# Altium schematic sheet LeaversDinner_invite_Sch.SchDoc
size A3; Author: Duleepa J Thrimawithana; Organization: Power Electronics Group; Address1: The University of Auckland; Address2: 20 Symonds Street; Address3: Auckland 1010; Address4: New Zealand; Revision: 1R0; SheetNumber: 1; SheetTotal: 1
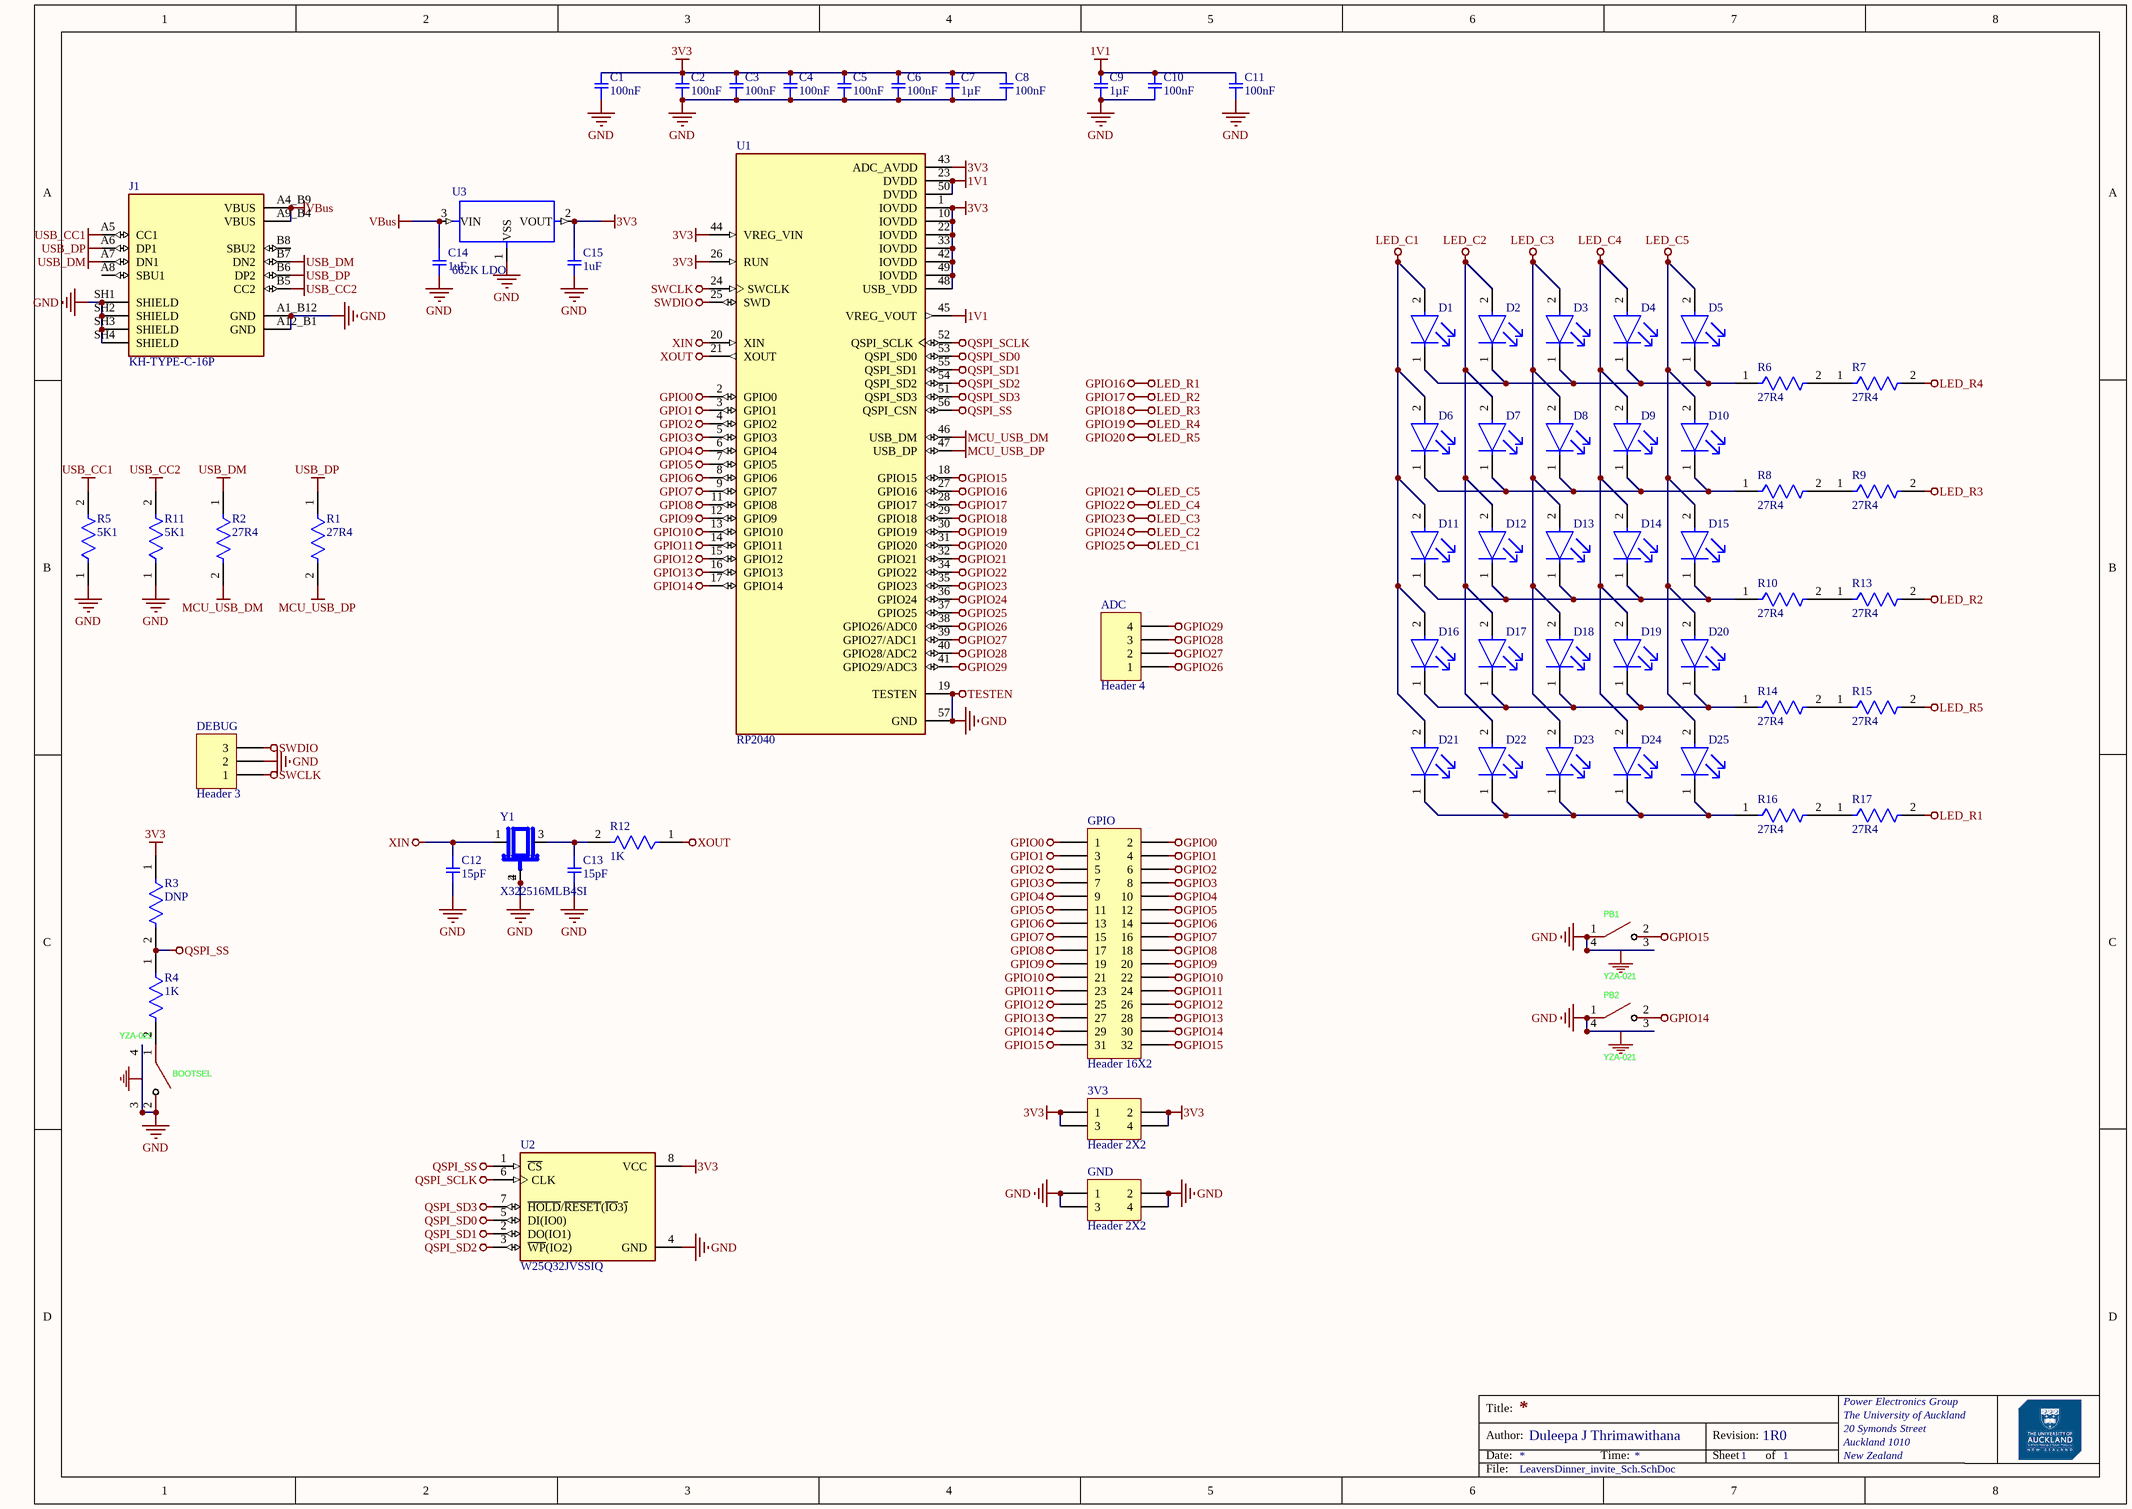
[diagram p0: LeaversDinner_invite_Sch.SchDoc]

## Parts
3V3  Header 2X2  [HDR2X2]
ADC  Header 4  [HDR1X4]
BOOTSEL  YZA-021  [SW-SMD_YZA-021]
C1  100nF  [SMD-0402C]
C2  100nF  [SMD-0402C]
C3  100nF  [SMD-0402C]
C4  100nF  [SMD-0402C]
C5  100nF  [SMD-0402C]
C6  100nF  [SMD-0402C]
C7  1µF  [SMD-0402C]
C8  100nF  [SMD-0402C]
C9  1µF  [SMD-0402C]
C10  100nF  [SMD-0402C]
C11  100nF  [SMD-0402C]
C12  15pF  [SMD-0402C]
C13  15pF  [SMD-0402C]
C14  1uF  [SMD-0402C]
C15  1uF  [SMD-0402C]
D1  VLMW1300-GS08  [FP-6_541-5091_01-4-MFG]  (value not drawn)
D2  VLMW1300-GS08  [FP-6_541-5091_01-4-MFG]  (value not drawn)
D3  VLMW1300-GS08  [FP-6_541-5091_01-4-MFG]  (value not drawn)
D4  VLMW1300-GS08  [FP-6_541-5091_01-4-MFG]  (value not drawn)
D5  VLMW1300-GS08  [FP-6_541-5091_01-4-MFG]  (value not drawn)
D6  VLMW1300-GS08  [FP-6_541-5091_01-4-MFG]  (value not drawn)
D7  VLMW1300-GS08  [FP-6_541-5091_01-4-MFG]  (value not drawn)
D8  VLMW1300-GS08  [FP-6_541-5091_01-4-MFG]  (value not drawn)
D9  VLMW1300-GS08  [FP-6_541-5091_01-4-MFG]  (value not drawn)
D10  VLMW1300-GS08  [FP-6_541-5091_01-4-MFG]  (value not drawn)
D11  VLMW1300-GS08  [FP-6_541-5091_01-4-MFG]  (value not drawn)
D12  VLMW1300-GS08  [FP-6_541-5091_01-4-MFG]  (value not drawn)
D13  VLMW1300-GS08  [FP-6_541-5091_01-4-MFG]  (value not drawn)
D14  VLMW1300-GS08  [FP-6_541-5091_01-4-MFG]  (value not drawn)
D15  VLMW1300-GS08  [FP-6_541-5091_01-4-MFG]  (value not drawn)
D16  VLMW1300-GS08  [FP-6_541-5091_01-4-MFG]  (value not drawn)
D17  VLMW1300-GS08  [FP-6_541-5091_01-4-MFG]  (value not drawn)
D18  VLMW1300-GS08  [FP-6_541-5091_01-4-MFG]  (value not drawn)
D19  VLMW1300-GS08  [FP-6_541-5091_01-4-MFG]  (value not drawn)
D20  VLMW1300-GS08  [FP-6_541-5091_01-4-MFG]  (value not drawn)
D21  VLMW1300-GS08  [FP-6_541-5091_01-4-MFG]  (value not drawn)
D22  VLMW1300-GS08  [FP-6_541-5091_01-4-MFG]  (value not drawn)
D23  VLMW1300-GS08  [FP-6_541-5091_01-4-MFG]  (value not drawn)
D24  VLMW1300-GS08  [FP-6_541-5091_01-4-MFG]  (value not drawn)
D25  VLMW1300-GS08  [FP-6_541-5091_01-4-MFG]  (value not drawn)
DEBUG  Header 3  [HDR1X3]
GND  Header 2X2  [HDR2X2]
GPIO  Header 16X2  [HDR2X16]
J1  KH-TYPE-C-16P  [KINGHELM_KH-TYPE-C-16P]
PB1  YZA-021  [SW-SMD_YZA-021]
PB2  YZA-021  [SW-SMD_YZA-021]
R1  27R4  [FP-MCR01-IPC_B]
R2  27R4  [FP-MCR01-IPC_B]
R3  DNP  [FP-MCR01-IPC_B]
R4  1K  [FP-MCR01-IPC_B]
R5  5K1  [FP-MCR01-IPC_B]
R6  27R4  [FP-MCR01-IPC_B]
R7  27R4  [FP-MCR01-IPC_B]
R8  27R4  [FP-MCR01-IPC_B]
R9  27R4  [FP-MCR01-IPC_B]
R10  27R4  [FP-MCR01-IPC_B]
R11  5K1  [FP-MCR01-IPC_B]
R12  1K  [FP-MCR01-IPC_B]
R13  27R4  [FP-MCR01-IPC_B]
R14  27R4  [FP-MCR01-IPC_B]
R15  27R4  [FP-MCR01-IPC_B]
R16  27R4  [FP-MCR01-IPC_B]
R17  27R4  [FP-MCR01-IPC_B]
U1  RP2040  [QFN40P700X700X90-57N]
U2  W25Q32JVSSIQ  [SOIC127P790X216-8N]
U3  662K LDO  [SOT-23]
Y1  X322516MLB4SI  [OSC_X322516MLB4SI]

## Nets
1V1: C9.2 C10.2 C11.2 U1.23(DVDD) U1.45(VREG_VOUT) U1.50(DVDD)
3V3: 3V3.1 3V3.2 3V3.3 3V3.4 C1.2 C2.2 C3.2 C4.2 C5.2 C6.2 C7.2 C8.2 C15.1 R3.1 U1.1(IOVDD) U1.10(IOVDD) U1.22(IOVDD) U1.26(RUN) U1.33(IOVDD) U1.42(IOVDD) U1.43(ADC_AVDD) U1.44(VREG_VIN) U1.48(USB_VDD) U1.49(IOVDD) U2.8(VCC) U3.2(VOUT)
GND: BOOTSEL.2 BOOTSEL.3 BOOTSEL.4 C1.1 C2.1 C3.1 C4.1 C5.1 C6.1 C7.1 C8.1 C9.1 C10.1 C11.1 C12.2 C13.2 C14.2 C15.2 DEBUG.2 GND.1 GND.2 GND.3 GND.4 J1.A1_B12(GND) J1.A12_B1(GND) J1.SH1(SHIELD) J1.SH2(SHIELD) J1.SH3(SHIELD) J1.SH4(SHIELD) PB1.1 PB1.3 PB1.4 PB2.1 PB2.3 PB2.4 R5.1 R11.1 U1.19(TESTEN) U1.57(GND) U2.4(GND) U3.1(VSS) Y1.2(GND) Y1.4(GND)  [also labelled TESTEN]
GPIO0: GPIO.1 GPIO.2 U1.2(GPIO0)
GPIO1: GPIO.3 GPIO.4 U1.3(GPIO1)
GPIO2: GPIO.5 GPIO.6 U1.4(GPIO2)
GPIO3: GPIO.7 GPIO.8 U1.5(GPIO3)
GPIO4: GPIO.9 GPIO.10 U1.6(GPIO4)
GPIO5: GPIO.11 GPIO.12 U1.7(GPIO5)
GPIO6: GPIO.13 GPIO.14 U1.8(GPIO6)
GPIO7: GPIO.15 GPIO.16 U1.9(GPIO7)
GPIO8: GPIO.17 GPIO.18 U1.11(GPIO8)
GPIO9: GPIO.19 GPIO.20 U1.12(GPIO9)
GPIO10: GPIO.21 GPIO.22 U1.13(GPIO10)
GPIO11: GPIO.23 GPIO.24 U1.14(GPIO11)
GPIO12: GPIO.25 GPIO.26 U1.15(GPIO12)
GPIO13: GPIO.27 GPIO.28 U1.16(GPIO13)
GPIO14: GPIO.29 GPIO.30 PB2.2 U1.17(GPIO14)
GPIO15: GPIO.31 GPIO.32 PB1.2 U1.18(GPIO15)
GPIO16: R17.2 U1.27(GPIO16)  [also labelled LED_R1]
GPIO17: R13.2 U1.28(GPIO17)  [also labelled LED_R2]
GPIO18: R9.2 U1.29(GPIO18)  [also labelled LED_R3]
GPIO19: R7.2 U1.30(GPIO19)  [also labelled LED_R4]
GPIO20: R15.2 U1.31(GPIO20)  [also labelled LED_R5]
GPIO21: D5.2(A) D10.2(A) D15.2(A) D20.2(A) D25.2(A) U1.32(GPIO21)  [also labelled LED_C5]
GPIO22: D4.2(A) D9.2(A) D14.2(A) D19.2(A) D24.2(A) U1.34(GPIO22)  [also labelled LED_C4]
GPIO23: D3.2(A) D8.2(A) D13.2(A) D18.2(A) D23.2(A) U1.35(GPIO23)  [also labelled LED_C3]
GPIO24: D2.2(A) D7.2(A) D12.2(A) D17.2(A) D22.2(A) U1.36(GPIO24)  [also labelled LED_C2]
GPIO25: D1.2(A) D6.2(A) D11.2(A) D16.2(A) D21.2(A) U1.37(GPIO25)  [also labelled LED_C1]
GPIO26: ADC.1 U1.38(GPIO26/ADC0)
GPIO27: ADC.2 U1.39(GPIO27/ADC1)
GPIO28: ADC.3 U1.40(GPIO28/ADC2)
GPIO29: ADC.4 U1.41(GPIO29/ADC3)
MCU_USB_DM: R2.2 U1.46(USB_DM)
MCU_USB_DP: R1.2 U1.47(USB_DP)
QSPI_SCLK: U1.52(QSPI_SCLK) U2.6(CLK)
QSPI_SD0: U1.53(QSPI_SD0) U2.5(DI(IO0))
QSPI_SD1: U1.55(QSPI_SD1) U2.2(DO(IO1))
QSPI_SD2: U1.54(QSPI_SD2) U2.3(~{WP}(IO2))
QSPI_SD3: U1.51(QSPI_SD3) U2.7(~{HOLD}/~{RESET}(~{IO}3~{)})
QSPI_SS: R3.2 R4.1 U1.56(QSPI_CSN) U2.1(~{CS})
SWCLK: DEBUG.1 U1.24(SWCLK)
SWDIO: DEBUG.3 U1.25(SWD)
USB_CC1: J1.A5(CC1) R5.2
USB_CC2: J1.B5(CC2) R11.2
USB_DM: J1.A7(DN1) J1.B7(DN2) R2.1
USB_DP: J1.A6(DP1) J1.B6(DP2) R1.1
VBus: C14.1 J1.A4_B9(VBUS) J1.A9_B4(VBUS) U3.3(VIN)
XIN: C12.1 U1.20(XIN) Y1.1
XOUT: R12.1 U1.21(XOUT)
NetBOOTSEL_1: BOOTSEL.1 R4.2
NetC13_1: C13.1 R12.2 Y1.3
NetD1_1: D1.1(C) D2.1(C) D3.1(C) D4.1(C) D5.1(C) R6.1
NetD6_1: D6.1(C) D7.1(C) D8.1(C) D9.1(C) D10.1(C) R8.1
NetD11_1: D11.1(C) D12.1(C) D13.1(C) D14.1(C) D15.1(C) R10.1
NetD16_1: D16.1(C) D17.1(C) D18.1(C) D19.1(C) D20.1(C) R14.1
NetD21_1: D21.1(C) D22.1(C) D23.1(C) D24.1(C) D25.1(C) R16.1
NetR6_2: R6.2 R7.1
NetR8_2: R8.2 R9.1
NetR10_2: R10.2 R13.1
NetR14_2: R14.2 R15.1
NetR16_2: R16.2 R17.1

Not connected (* = marked no-connect by the designer): J1 A8(SBU1) B8(SBU2)

## Notes on the sheet
- Title:
- Author:
- Date:
- Time:
- Revision:
- Sheet
- of
- File:

## Library data of the parts
3V3 GND = Header 2X2: Header, 2-Pin, Dual row; LatestRevisionDate: 17-Jul-2002; LatestRevisionNote: Re-released for DXP Platform.; Publisher: Altium Limited
ADC = Header 4: Header, 4-Pin; LatestRevisionDate: 17-Jul-2002; LatestRevisionNote: Re-released for DXP Platform.; Publisher: Altium Limited
BOOTSEL PB1 PB2 = YZA-021: Manufacturer: YIZHI(逸致); Add into BOM: yes; Switch Size: 2*4*3.5MM; Installation Method: Surface Mount; RatedCurrent: 50mA; ApplicableTemperatureRange: -10°C to +60°C; ButtonShape: Rectangle button; WorkingLife: 50,000 Cycles; Circuit: SPST; Symbol: YZA-021; Device: YZA-021; LCSC Part Name: YIZHI(逸致) YZA-021 2*4*3.5MM侧按轻触开关; Supplier Part: C49108617; Manufacturer Part: YZA-021; Supplier Footprint: -; JLCPCB Part Class: Extended Part; Datasheet: https://item.szlcsc.com/datasheet/YZA-021/51487234.html; Supplier: LCSC; Convert to PCB: yes; StorageTemperatureRange: -40°C to +80°C; Type: Tactile Switch
C1-C15 = GCM155C71A105KE38D: CAP CER 1UF 10V X7S 0402; Manufacturer: Murata Electronics North America; Factory Stock: 0; Unit Price (USD): 0.12; Minimum Quantity: 1; Tolerance: ±10%; Datasheets: http://www.murata.com/~/media/webrenewal/support/library/catalog/products/capacitor/mlcc/c03e.ashx; Image: //media.digikey.com/Renders/Murata%20Renders/ZRB-SERIES-0402.jpg; Digi-Key Part Number: 490-13409-1-ND; Part Number: GCM155C71A105KE38D; Quantity Available: 7240; @ qty: 0; Packaging: Cut Tape (CT); Series: GCM; Part Status: Active; Voltage: 10V; Temperature Coefficient: X7S; Operating Temperature: -55°C ~ 125°C; Features: -; Ratings: AEC-Q200; Applications: Automotive; Mounting Type: Surface Mount, MLCC; Package / Case: 0402 (1005 Metric); Size / Dimension: 0.039" L x 0.020" W (1.00mm x 0.50mm); Height - Seated (Max): -; Thickness (Max): 0.022" (0.55mm); Lead Spacing: -; Lead Style: -
  C1-C6 C8 C10 C11: Value: 100nF
  C7 C9: Value: 1µF
  C12 C13: Value: 15pF
  C14 C15: Value: 1uF
D1-D25 = CMP-02520-000007-1: LED COOL WHITE 0603 SMD; Manufacturer: Vishay; Viewing Angle: 130°; Forward Voltage: 3.15V; Luminous Intensity: 180mcd; Forward Current: 5mA; Led Orientation: Top View; Power Dissipation: 70mW; Category: Diode; Manufacturer Part Number: VLMW1300-GS08; Device Class L2: LEDs; Device Class L1: Optoelectronics; ComponentLink2URL: http://www.vishay.com/docs/82435/vlmw1300.pdf; Octopart: https://octopart.com/vlmw1300-gs08-vishay-21709203; Mouser Description: LED; SMD; 0603; white cold; 45-180mcd; 7000(typ)K; 130°; 5mA; Automotive: No; Ambient Temperature Range High: +80°C; Colour: White; Device Class L3: unset; Temperature Range High: +80°C; Height: 0.75mm; Package: 6.541-5091.01-4; RoHS: TRUE; Digikey Description: LED COOL WHITE 0603 SMD; Lead Free: Yes; Ambient Temperature Range Low: -20°C; ComponentLink2Description: Datasheet; Temperature Range Low: -20°C; Temperature: -20°C to +80°C
DEBUG = Header 3: Header, 3-Pin; LatestRevisionDate: 17-Jul-2002; LatestRevisionNote: Re-released for DXP Platform.; Publisher: Altium Limited
GPIO = Header 16X2: Header, 16-Pin, Dual row; LatestRevisionDate: 17-Jul-2002; LatestRevisionNote: Re-released for DXP Platform.; Publisher: Altium Limited
J1 = KH-TYPE-C-16P: MF: kinghelm; SnapEDA_Link: https://www.snapeda.com/parts/KH-TYPE-C-16P/Kinghelm/view-part/?ref=snap; Package: None; Value: *; MP: KH-TYPE-C-16P; Check_prices: https://www.snapeda.com/parts/KH-TYPE-C-16P/Kinghelm/view-part/?ref=eda
R1-R17 = CMP-08839-006364-1: Thick Film Chip Resistor, 0402, 10MΩ, 5%, 200ppm/°C, 0.063W, 50V; Power Rating: 63mW; Resistor Type: Thick Film; Max Operating Temperature: 155°C; Voltage Rating (DC): 50V; Length: 1mm; Lead Free: Lead Free; Depth: 0.5mm; Min Operating Temperature: -55°C; Military Standard: Not; Case/Package: Molded; Packaging: Tape and Reel; Tolerance: 5%
  R1 R2 R6-R10 R13-R17: Resistance: 27R4
  R3: Resistance: DNP
  R4 R12: Resistance: 1K
  R5 R11: Resistance: 5K1
U1 = RP2040: RP2040 chip for Raspberry Pi Pico - ARM® Cortex®-M0+ MCU 32-Bit; SnapEDA_Link: https://www.snapeda.com/parts/RP2040/Raspberry+Pi/view-part/?ref=snap; Package: None; Value: *; MF: Raspberry Pi; MP: RP2040; Check_prices: https://www.snapeda.com/parts/RP2040/Raspberry+Pi/view-part/?ref=eda
U2 = W25Q32JVSSIQ: FLASH - NOR Memory IC 32Mb (4M x 8) SPI - Quad I/O 133 MHz 8-SOIC; MF: Winbond; SnapEDA_Link: https://www.snapeda.com/parts/W25Q32JVSSIQ/Winbond+Electronics/view-part/?ref=snap; Package: SOIC-8 Winbond; Value: *; MP: W25Q32JVSSIQ; Check_prices: https://www.snapeda.com/parts/W25Q32JVSSIQ/Winbond+Electronics/view-part/?ref=eda
U3 = PMIC-LDO-XC6206P332MR-G(SOT23): Linear Voltage Regulator IC Positive Fixed 1 Output 300mA SOT-23; MF: Torex; Check_prices: https://www.snapeda.com/parts/XC6206P332MR-G/Torex/view-part/?ref=eda; Purchase-URL: https://pricing.snapeda.com/search/part/XC6206P332MR-G/?ref=eda; Value: *; Availability: In Stock; Package: SOT-23-3 Torex; SnapEDA_Link: https://www.snapeda.com/parts/XC6206P332MR-G/Torex/view-part/?ref=snap; MP: XC6206P332MR-G; Price: None
Y1 = X322516MLB4SI: External dimensions: 3.2 x 2.5 x 0.8 mm.Frequency range: 11.0592MHz ~54MHz; MF: YXC; SnapEDA_Link: https://www.snapeda.com/parts/X322516MLB4SI/YXC/view-part/?ref=snap; Package: Package; Value: *; MP: X322516MLB4SI; Check_prices: https://www.snapeda.com/parts/X322516MLB4SI/YXC/view-part/?ref=eda